# Altium schematic sheet P[05]_PMIC.SchDoc
size 513 x 386 mm
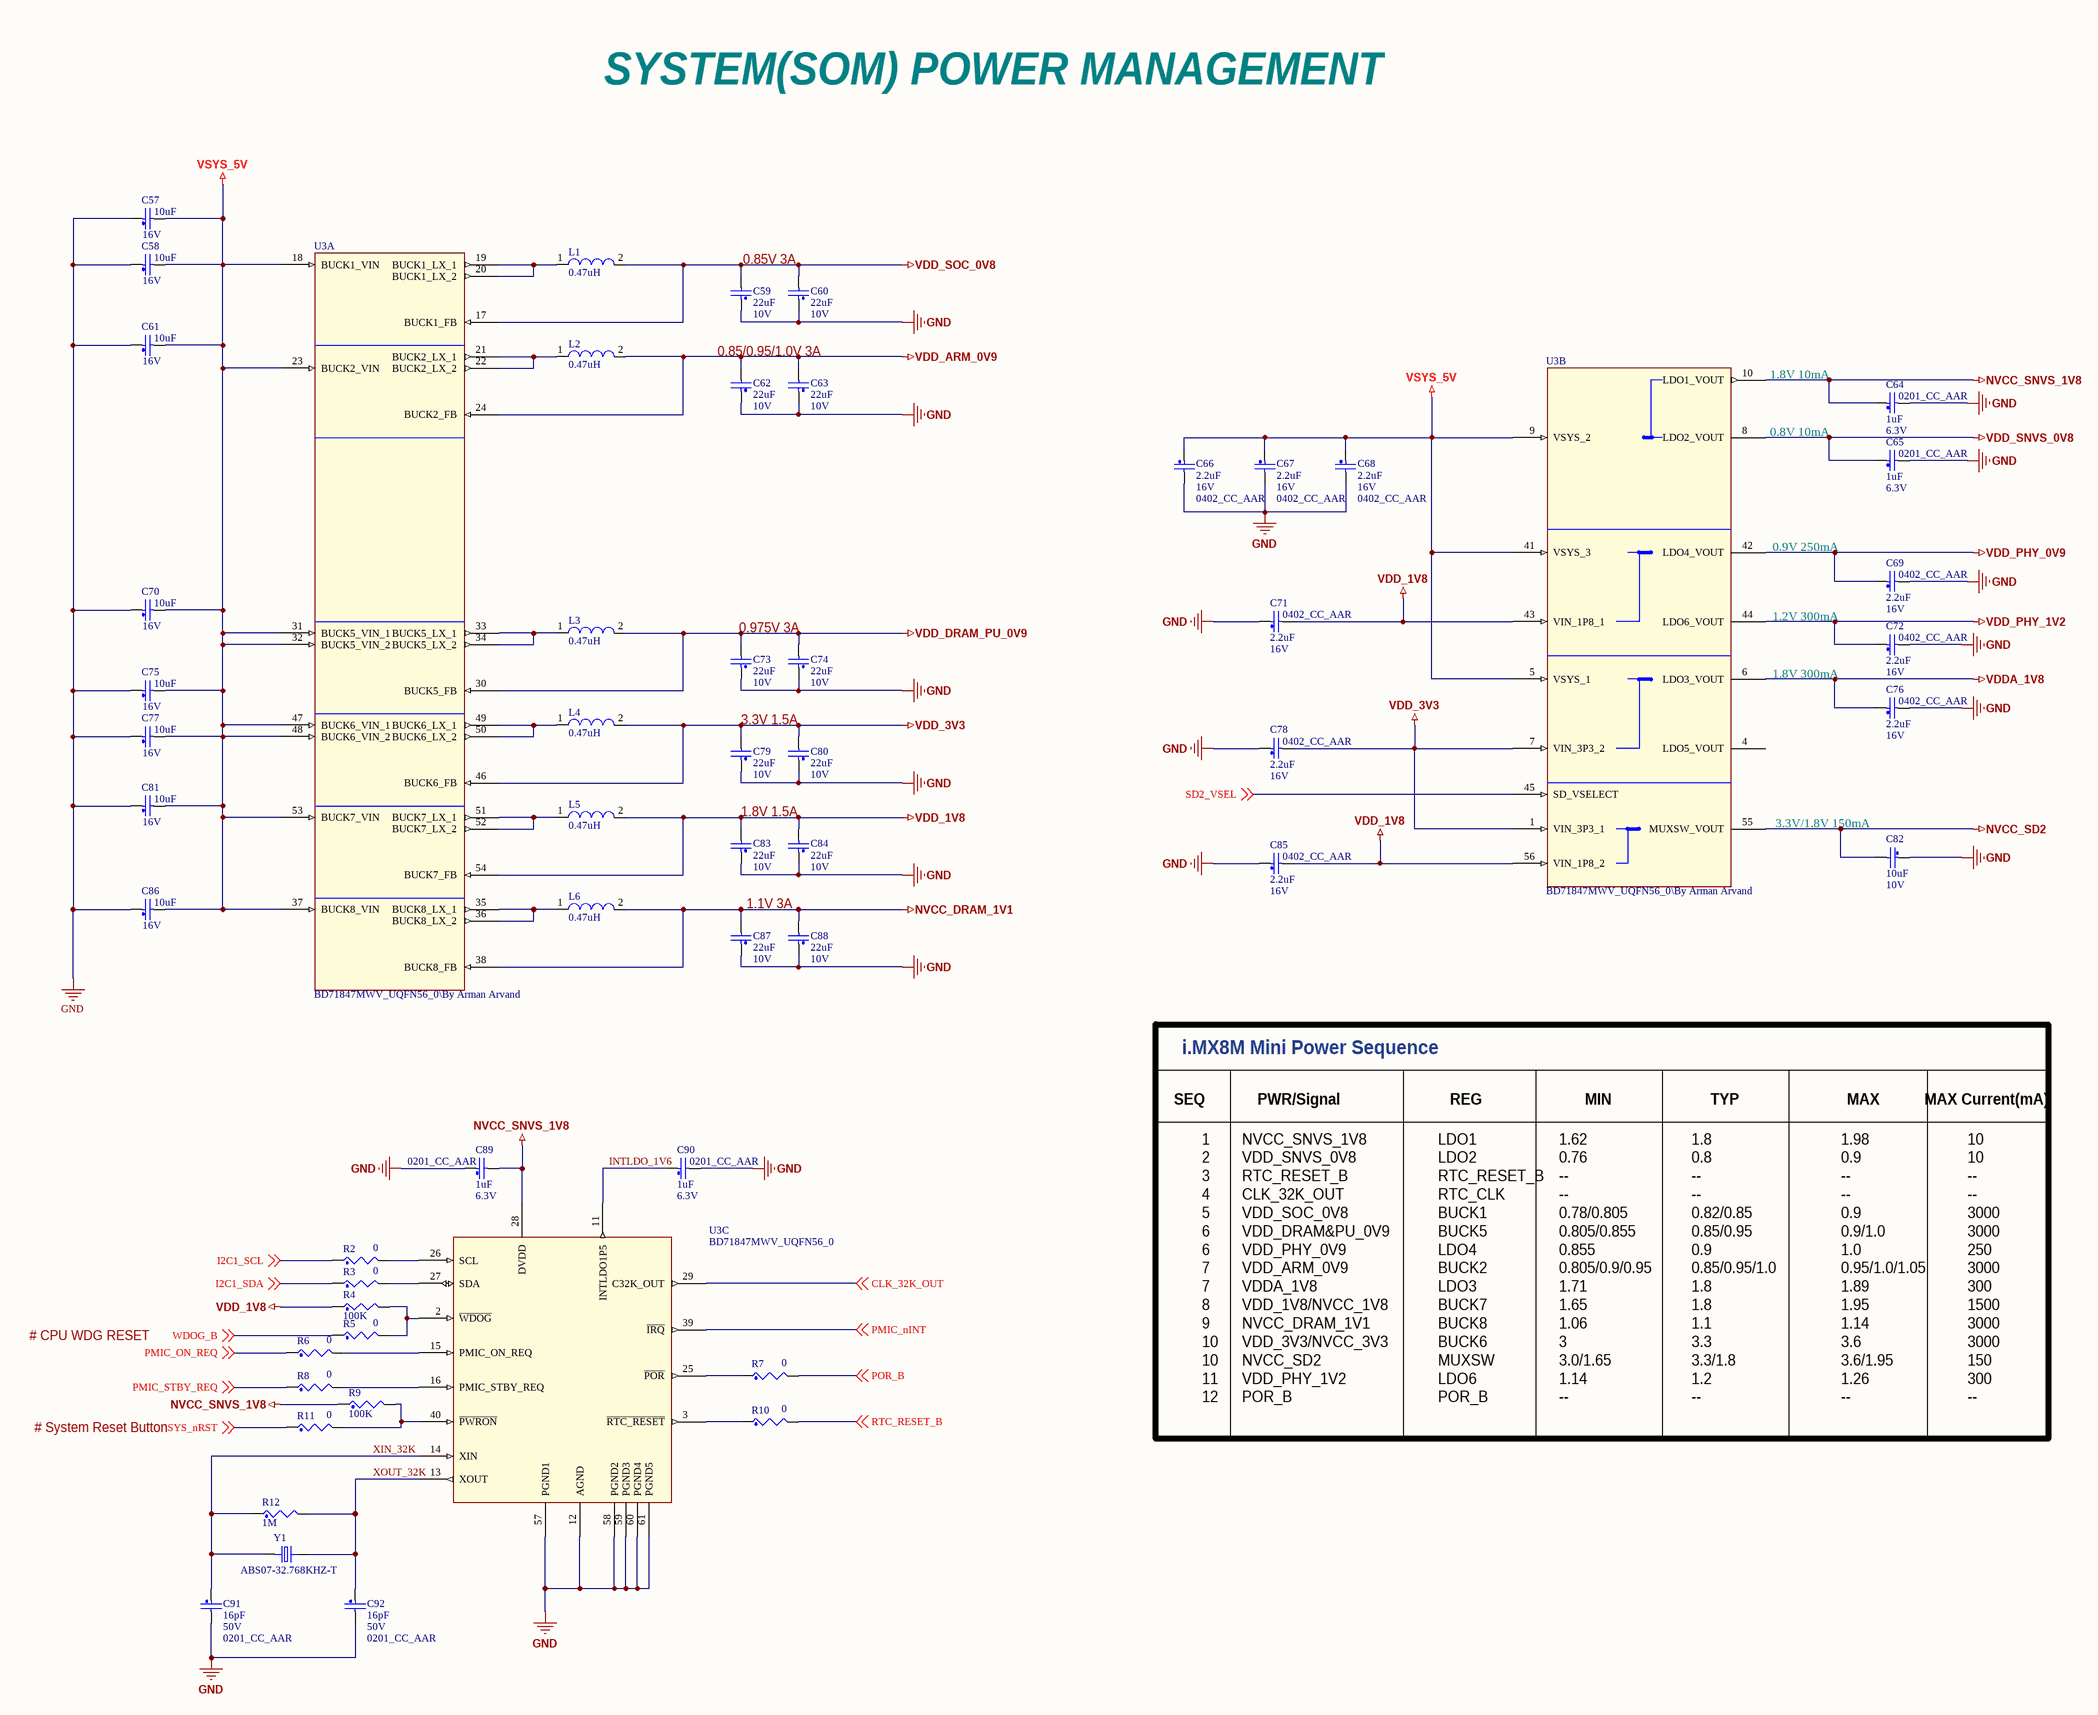
[diagram p0: P[05]_PMIC.SchDoc]

## Parts
C57  10uF  Voltage: 16V  [0603_CC]
C58  10uF  Voltage: 16V  [0603_CC]
C59  22uF  Voltage: 10V  [0603_CC]
C60  22uF  Voltage: 10V  [0603_CC]
C61  10uF  Voltage: 16V  [0603_CC]
C62  22uF  Voltage: 10V  [0603_CC]
C63  22uF  Voltage: 10V  [0603_CC]
C64  1uF  Voltage: 6.3V  footprint: 0201_CC_AAR  [0201_CC - C]
C65  1uF  Voltage: 6.3V  footprint: 0201_CC_AAR  [0201_CC - C]
C66  2.2uF  Voltage: 16V  footprint: 0402_CC_AAR  [0402_CC - C]
C67  2.2uF  Voltage: 16V  footprint: 0402_CC_AAR  [0402_CC - C]
C68  2.2uF  Voltage: 16V  footprint: 0402_CC_AAR  [0402_CC - C]
C69  2.2uF  Voltage: 16V  footprint: 0402_CC_AAR  [0402_CC - C]
C70  10uF  Voltage: 16V  [0603_CC]
C71  2.2uF  Voltage: 16V  footprint: 0402_CC_AAR  [0402_CC - C]
C72  2.2uF  Voltage: 16V  footprint: 0402_CC_AAR  [0402_CC - C]
C73  22uF  Voltage: 10V  [0603_CC]
C74  22uF  Voltage: 10V  [0603_CC]
C75  10uF  Voltage: 16V  [0603_CC]
C76  2.2uF  Voltage: 16V  footprint: 0402_CC_AAR  [0402_CC - C]
C77  10uF  Voltage: 16V  [0603_CC]
C78  2.2uF  Voltage: 16V  footprint: 0402_CC_AAR  [0402_CC - C]
C79  22uF  Voltage: 10V  [0603_CC]
C80  22uF  Voltage: 10V  [0603_CC]
C81  10uF  Voltage: 16V  [0603_CC]
C82  10uF  Voltage: 10V  [0603_CC]
C83  22uF  Voltage: 10V  [0603_CC]
C84  22uF  Voltage: 10V  [0603_CC]
C85  2.2uF  Voltage: 16V  footprint: 0402_CC_AAR  [0402_CC - C]
C86  10uF  Voltage: 16V  [0603_CC]
C87  22uF  Voltage: 10V  [0603_CC]
C88  22uF  Voltage: 10V  [0603_CC]
C89  1uF  Voltage: 6.3V  footprint: 0201_CC_AAR  [0201_CC - C]
C90  1uF  Voltage: 6.3V  footprint: 0201_CC_AAR  [0201_CC - C]
C91  16pF  Voltage: 50V  footprint: 0201_CC_AAR  [0201_CC - C]
C92  16pF  Voltage: 50V  footprint: 0201_CC_AAR  [0201_CC - C]
L1  0.47uH  [IND_SPH2520]
L2  0.47uH  [IND_SPH2520]
L3  0.47uH  [IND_SPH2520]
L4  0.47uH  [IND_SPH2520]
L5  0.47uH  [IND_SPH2520]
L6  0.47uH  [IND_SPH2520]
R2  0  [0402_CC]
R3  0  [0402_CC]
R4  100K  [0201_CC]
R5  0  [0402_CC]
R6  0  [0402_CC]
R7  0  [0402_CC]
R8  0  [0402_CC]
R9  100K  [0201_CC]
R10  0  [0402_CC]
R11  0  [0402_CC]
R12  1M  [0201_CC]
U3  BD71847MWV_UQFN56_0\By Arman Arvand  [UQFN56_0P4_7X7_EP_S185]  (parts A,B,C of 3)
Y1  ABS07-32.768KHZ-T  [XTAL_ABS07-32.768KHZ-T]

## Nets
GND: C57.1 C58.1 C59.1 C60.1 C61.1 C62.1 C63.1 C64.2 C65.2 C66.2 C67.2 C68.2 C69.2 C70.1 C71.1 C72.2 C73.1 C74.1 C75.1 C76.2 C77.1 C78.1 C79.1 C80.1 C81.1 C82.1 C83.1 C84.1 C85.1 C86.1 C87.1 C88.1 C89.1 C90.2 C91.2 C92.2 U3.12(AGND) U3.57(PGND1) U3.58(PGND2) U3.59(PGND3) U3.60(PGND4) U3.61(PGND5)
NVCC_DRAM_1V1: C87.2 C88.2 L6.2 U3.38(BUCK8_FB)
NVCC_SD2: C82.2 U3.55(MUXSW_VOUT)
NVCC_SNVS_1V8: C64.1 C89.2 R9.1 U3.10(LDO1_VOUT) U3.28(DVDD)
VDD_1V8: C71.2 C83.2 C84.2 C85.2 L5.2 R4.1 U3.43(VIN_1P8_1) U3.54(BUCK7_FB) U3.56(VIN_1P8_2)
VDD_3V3: C78.2 C79.2 C80.2 L4.2 U3.1(VIN_3P3_1) U3.7(VIN_3P3_2) U3.46(BUCK6_FB)
VDD_ARM_0V9: C62.2 C63.2 L2.2 U3.24(BUCK2_FB)
VDD_DRAM_PU_0V9: C73.2 C74.2 L3.2 U3.30(BUCK5_FB)
VDD_PHY_0V9: C69.1 U3.42(LDO4_VOUT)
VDD_PHY_1V2: C72.1 U3.44(LDO6_VOUT)
VDD_SNVS_0V8: C65.1 U3.8(LDO2_VOUT)
VDD_SOC_0V8: C59.2 C60.2 L1.2 U3.17(BUCK1_FB)
VDDA_1V8: C76.1 U3.6(LDO3_VOUT)
VSYS_5V: C57.2 C58.2 C61.2 C66.1 C67.1 C68.1 C70.2 C75.2 C77.2 C81.2 C86.2 U3.5(VSYS_1) U3.9(VSYS_2) U3.18(BUCK1_VIN) U3.23(BUCK2_VIN) U3.31(BUCK5_VIN_1) U3.32(BUCK5_VIN_2) U3.37(BUCK8_VIN) U3.41(VSYS_3) U3.47(BUCK6_VIN_1) U3.48(BUCK6_VIN_2) U3.53(BUCK7_VIN)
CLK_32K_OUT: U3.29(C32K_OUT) ; off-sheet CLK_32K_OUT
I2C1_SCL: R2.1 ; off-sheet I2C1_SCL
I2C1_SDA: R3.1 ; off-sheet I2C1_SDA
INTLDO_1V6: C90.1 U3.11(INTLDO1P5)
PMIC_nINT: U3.39(~{IRQ}) ; off-sheet PMIC_nINT
PMIC_ON_REQ: R6.1 ; off-sheet PMIC_ON_REQ
PMIC_STBY_REQ: R8.1 ; off-sheet PMIC_STBY_REQ
POR_B: R7.2 ; off-sheet POR_B
RTC_RESET_B: R10.2 ; off-sheet RTC_RESET_B
SD2_VSEL: U3.45(SD_VSELECT) ; off-sheet SD2_VSEL
SYS_nRST: R11.1 ; off-sheet SYS_nRST
WDOG_B: R5.1 ; off-sheet WDOG_B
XIN_32K: C91.1 R12.1 U3.14(XIN) Y1.1
XOUT_32K: C92.1 R12.2 U3.13(XOUT) Y1.2
NetL1_1: L1.1 U3.19(BUCK1_LX_1) U3.20(BUCK1_LX_2)
NetL2_1: L2.1 U3.21(BUCK2_LX_1) U3.22(BUCK2_LX_2)
NetL3_1: L3.1 U3.33(BUCK5_LX_1) U3.34(BUCK5_LX_2)
NetL4_1: L4.1 U3.49(BUCK6_LX_1) U3.50(BUCK6_LX_2)
NetL5_1: L5.1 U3.51(BUCK7_LX_1) U3.52(BUCK7_LX_2)
NetL6_1: L6.1 U3.35(BUCK8_LX_1) U3.36(BUCK8_LX_2)
NetR2_2: R2.2 U3.26(SCL)
NetR3_2: R3.2 U3.27(SDA)
NetR4_2: R4.2 R5.2 U3.2(~{WDOG})
NetR6_2: R6.2 U3.15(PMIC_ON_REQ)
NetR7_1: R7.1 U3.25(~{POR})
NetR8_2: R8.2 U3.16(PMIC_STBY_REQ)
NetR9_2: R9.2 R11.2 U3.40(~{PWRON})
NetR10_1: R10.1 U3.3(~{RTC_RESET})

Not connected (* = marked no-connect by the designer): U3 4(LDO5_VOUT)

## Notes on the sheet
- SYSTEM(SOM) POWER MANAGEMENT
- 0.85V 3A
- 0.85/0.95/1.0V 3A
- 1.8V 10mA
- 0.8V 10mA
- 0.9V 250mA
- 0.975V 3A
- 1.2V 300mA
- 1.8V 300mA
- 3.3V 1.5A
- 1.8V 1.5A
- 3.3V/1.8V 150mA
- 1.1V 3A
- i.MX8M Mini Power Sequence
- SEQ
- PWR/Signal
- REG
- MIN
- TYP
- MAX
- MAX Current(mA)
- # CPU WDG RESET
- # System Reset Button
- 1
  2
  3
  4
  5
  6
  6
  7
  7
  8
  9
  10
  10
  11
  12
- NVCC_SNVS_1V8
  VDD_SNVS_0V8
  RTC_RESET_B
  CLK_32K_OUT
  VDD_SOC_0V8
  VDD_DRAM&PU_0V9
  VDD_PHY_0V9
  VDD_ARM_0V9
  VDDA_1V8
  VDD_1V8/NVCC_1V8
  NVCC_DRAM_1V1
  VDD_3V3/NVCC_3V3
  NVCC_SD2
  VDD_PHY_1V2
  POR_B
- LDO1
  LDO2
  RTC_RESET_B
  RTC_CLK
  BUCK1
  BUCK5
  LDO4
  BUCK2
  LDO3
  BUCK7
  BUCK8
  BUCK6
  MUXSW
  LDO6
  POR_B
- 1.62
  0.76
  --
  --
  0.78/0.805
  0.805/0.855
  0.855
  0.805/0.9/0.95
  1.71
  1.65
  1.06
  3
  3.0/1.65
  1.14
  --
- 1.8
  0.8
  --
  --
  0.82/0.85
  0.85/0.95
  0.9
  0.85/0.95/1.0
  1.8
  1.8
  1.1
  3.3
  3.3/1.8
  1.2
  --
- 1.98
  0.9
  --
  --
  0.9
  0.9/1.0
  1.0
  0.95/1.0/1.05
  1.89
  1.95
  1.14
  3.6
  3.6/1.95
  1.26
  --
- 10
  10
  --
  --
  3000
  3000
  250
  3000
  300
  1500
  3000
  3000
  150
  300
  --

## Library data of the parts
C57-C92 = CAP_NP: CLASS: DISCRETE
L1-L6 = INDUCTOR: CLASS: DISCRETE
R2-R12 = RES: CLASS: DISCRETE
U3 = BD71847MWV_UQFN56_0: CLASS: IC
Y1 = ABS07-32.768KHZ-T: 32.768kHz Â±20ppm Crystal 12.5pF 70 kOhms 2-SMD, No Lead; MF: Abracon LLC; Price: None; Value: *; Package: SMD-2 Abracon; Availability: Unavailable; SnapEDA_Link: https://www.snapeda.com/parts/ABS07-32.768KHZ/Abracon%20LLC/view-part/448682/?ref=snap; MP: ABS07-32.768KHZ